# Altium project ServoDrive.PrjPCB
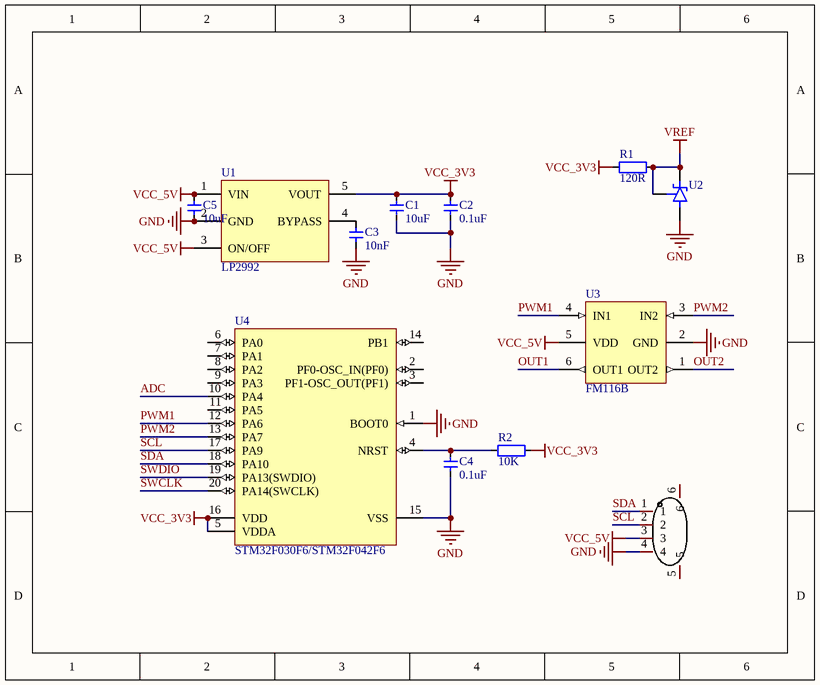
[diagram p0: Main.SchDoc]
1 sheet, 12 parts. Net scope: hierarchical (ports join the sheet entries above them; power ports are global).
Board file: ServoDrive.PcbDoc

## Sheet Main.SchDoc
size 152 x 127 mm; SheetNumber: 1

### Parts
C1  10uF  [CAP_0402]
C2  0.1uF  [CAP_0402]
C3  10nF  [CAP_0402]
C4  0.1uF  [CAP_0402]
C5  10uF  [CAP_0402]
FPC1  0.5K-DX-4PWB  [FPC-SMD_4P-P0.50_DEALON_0.5K-DX-4PWB]  (value not drawn)
R1  120R  [RES_0402]
R2  10K  [RES_0402]
U1  LP2992  [SOT23-5]
U2  TL431IDBZT  [SOT23-3]  (value not drawn)
U3  FM116B  [SOT23-6]
U4  STM32F030F6/STM32F042F6  [TSSOP-20]

### Nets
GND: C1.1 C2.1 C3.2 C4.1 C5.1 FPC1.4 U1.2(GND) U2.3(ANODE) U3.2(GND) U4.1(BOOT0) U4.15(VSS)
VCC_3V3: C1.2 C2.2 R1.1 R2.1 U1.5(VOUT) U4.5(VDDA) U4.16(VDD)
VCC_5V: C5.2 FPC1.3 U1.1(VIN) U1.3(ON/OFF) U3.5(VDD)
VREF: R1.2 U2.1(CATHODE) U2.2(REF)
ADC: U4.10(PA4)  [project net ADC_1]
OUT1: U3.6(OUT1)  [project net OUT1_1]
OUT2: U3.1(OUT2)  [project net OUT2_1]
PWM1: U3.4(IN1) U4.12(PA6)  [project net PWM1_1]
PWM2: U3.3(IN2) U4.13(PA7)  [project net PWM2_1]
SCL: FPC1.2 U4.17(PA9)  [project net SCL_1]
SDA: FPC1.1 U4.18(PA10)  [project net SDA_1]
SWCLK: U4.20(PA14(SWCLK))  [project net SWCLK_1]
SWDIO: U4.19(PA13(SWDIO))  [project net SWDIO_1]
NetC3_1: C3.1 U1.4(BYPASS)
NetC4_2: C4.2 R2.2 U4.4(NRST)

Not connected (* = marked no-connect by the designer): FPC1 5 6; U4 2(PF0-OSC_IN(PF0)) 3(PF1-OSC_OUT(PF1)) 6(PA0) 7(PA1) 8(PA2) 9(PA3) 11(PA5) 14(PB1)

### Library data of the parts
C1-C5 = 电容-0402: Capacitor; Value: 0.1u
FPC1 = 0.5K-DX-4PWB: Manufacturer: HDGC(华德共创); Add into BOM: yes; Pitch: 0.5mm; Number of Contacts: 4; Locking Feature: 翻盖式; FFC, FCB Thickness: 0.3mm; Name: 0.5K-DX-4PWB; Symbol: 0.5K-DX-4PWB; Device: 0.5K-DX-4PWB; LCSC Part Name: 0.5mm P数:4 翻盖式 下接; Supplier Part: C2911830; Manufacturer Part: 0.5K-DX-4PWB; Supplier Footprint: SMD,P=0.5mm; JLCPCB Part Class: Extended Part; Datasheet: https://atta.szlcsc.com/upload/public/pdf/source/20211029/5210AEC837E1AC9B697C39805C1E664F.pdf; Supplier: LCSC; Convert to PCB: yes; Mounting Type: 卧贴; Contact Type: 下接; Height Above Board: 2mm; Operating Temperature Range: -20℃~+85℃
R1 R2 = 电阻-0402: Resistor; Value: 22R
U1 = LP2992: LDO
U2 = TL431IDBZT: Adjustable precision shunt regulator 3-SOT-23 -40 to 85; MF: Texas Instruments; Price: None; Package: SOT-23-3 Texas Instruments; Check_prices: https://www.snapeda.com/parts/TL431IDBZT/Texas%20Instruments/view-part/1206577/?ref=eda; Availability: Warning; MP: TL431IDBZT; Value: *; SnapEDA_Link: https://www.snapeda.com/parts/TL431IDBZT/Texas%20Instruments/view-part/1206577/?ref=snap; Purchase-URL: https://pricing.snapeda.com/search/part/TL431IDBZT/?ref=eda
U3 = FM116B: PartNumber: 24LC256-I/ST; Code_JEDEC: MO-153; PackageVersion: revBB, Aug-2009; PackageReference: TSSOP-ST8; PackageDescription: 8-Lead Plastic Thin Shrink Small Outline (ST) - 4.4mm Body [TSSOP]; DatasheetVersion: revP, Oct-2007
U4 = STM32F030F4P6: ARM Cortex-M0 32-bit MCU, 16 KB Flash, 4 KB Internal RAM, 15 I/Os, 20-pin TSSOP, -40 to 85 degC, Tube; FLASH Size (Prog) (kB): 16; I/Os (High Current): 15; Internal RAM Size (kB): 4; Operating Frequency(F) (Processor speed) (MHz): 48; Supply Voltage(Vcc) min (V): 2.4; DatasheetVersion: Rev. 1; PackageVersion: Rev. 1, 11/2012; PackageReference: TSSOP20; PackageDescription: 20-Pin Thin Shrink Small Outline Package, 6.5 x 4.4 mm Body, 0.65 mm Pitch; Supplier 1: Digi-Key; Supplier Part Number 1: 497-14044-5-ND; Supplier 2: Newark; Supplier Part Number 2: 06X3648; Supplier 3: Mouser; Supplier Part Number 3: 511-STM32F030F4P6; Core: ARM Cortex-M0; Packing: Tube; Mounting Technology: Surface Mount; PartNumber: STM32F030F4P6; ComponentLink1Description: Manufacturer URL; ComponentLink1URL: http://www.st.com/web/en/home.html; ComponentLink2Description: Datasheet; ComponentLink2URL: http://www.st.com/st-web-ui/static/active/en/resource/technical/document/datasheet/DM00088500.pdf; ComponentLink3Description: Package Specification; ComponentLink3URL: http://www.st.com/st-web-ui/static/active/en/resource/technical/document/datasheet/DM00065136.pdf